# Altium schematic sheet Slider.SchDoc
size A
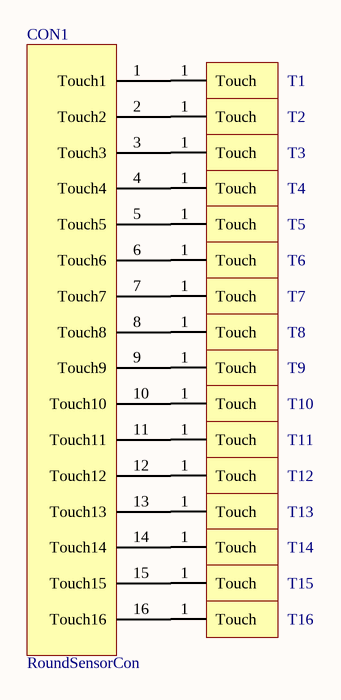
[diagram p0: Slider.SchDoc]

## Parts
CON1  RoundSensorCon  [RoundSensorCon]
T1  Touch  [TOUCH]  (value not drawn)
T2  Touch  [TOUCH]  (value not drawn)
T3  Touch  [TOUCH]  (value not drawn)
T4  Touch  [TOUCH]  (value not drawn)
T5  Touch  [TOUCH]  (value not drawn)
T6  Touch  [TOUCH]  (value not drawn)
T7  Touch  [TOUCH]  (value not drawn)
T8  Touch  [TOUCH]  (value not drawn)
T9  Touch  [TOUCH]  (value not drawn)
T10  Touch  [TOUCH]  (value not drawn)
T11  Touch  [TOUCH]  (value not drawn)
T12  Touch  [TOUCH]  (value not drawn)
T13  Touch  [TOUCH]  (value not drawn)
T14  Touch  [TOUCH]  (value not drawn)
T15  Touch  [TOUCH]  (value not drawn)
T16  Touch  [TOUCH]  (value not drawn)

## Nets
NetCON1_1: CON1.1(Touch1) T1.1(Touch)
NetCON1_2: CON1.2(Touch2) T2.1(Touch)
NetCON1_3: CON1.3(Touch3) T3.1(Touch)
NetCON1_4: CON1.4(Touch4) T4.1(Touch)
NetCON1_5: CON1.5(Touch5) T5.1(Touch)
NetCON1_6: CON1.6(Touch6) T6.1(Touch)
NetCON1_7: CON1.7(Touch7) T7.1(Touch)
NetCON1_8: CON1.8(Touch8) T8.1(Touch)
NetCON1_9: CON1.9(Touch9) T9.1(Touch)
NetCON1_10: CON1.10(Touch10) T10.1(Touch)
NetCON1_11: CON1.11(Touch11) T11.1(Touch)
NetCON1_12: CON1.12(Touch12) T12.1(Touch)
NetCON1_13: CON1.13(Touch13) T13.1(Touch)
NetCON1_14: CON1.14(Touch14) T14.1(Touch)
NetCON1_15: CON1.15(Touch15) T15.1(Touch)
NetCON1_16: CON1.16(Touch16) T16.1(Touch)